# EAGLE schematic WiFiThermostat (EAGLE 6.2)
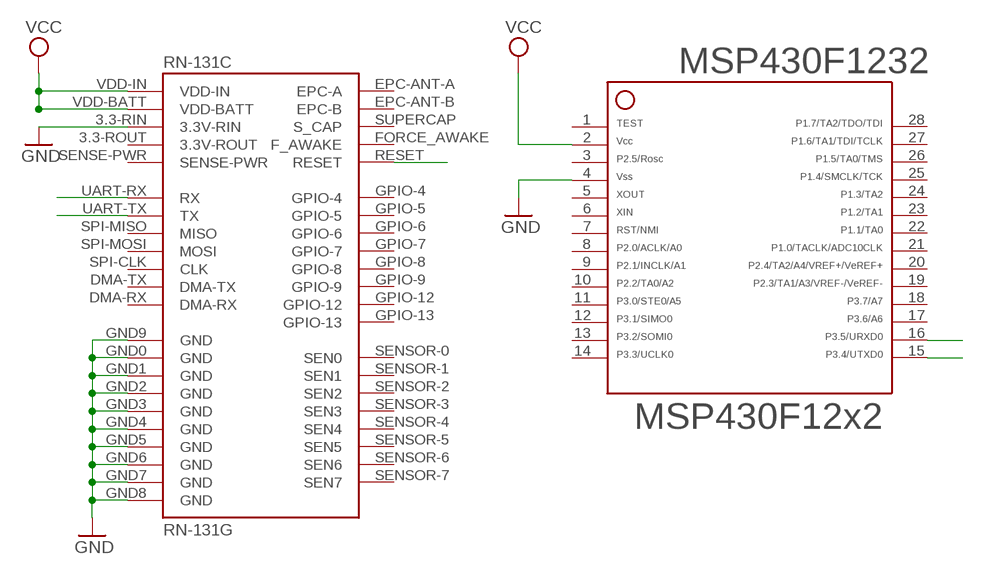
[diagram p0: schematic, sheet 1]

## Parts
MSP430F1232  F12X2---DW28  [DW28]
RN-131C  RN-131G  [RN-131G]

## Nets
GND: MSP430F1232.4 RN-131C.3.3-RIN(3.3V-RIN) RN-131C.GND0(GND) RN-131C.GND1(GND) RN-131C.GND2(GND) RN-131C.GND3(GND) RN-131C.GND4(GND) RN-131C.GND5(GND) RN-131C.GND6(GND) RN-131C.GND7(GND) RN-131C.GND8(GND) RN-131C.GND9(GND)
RESET: RN-131C.RESET
RN-RX: MSP430F1232.15 RN-131C.UART-RX(RX)
RN-TX: MSP430F1232.16 RN-131C.UART-TX(TX)
VCC: MSP430F1232.2 RN-131C.VDD-BATT RN-131C.VDD-IN
Unconnected: MSP430F1232.1 MSP430F1232.3 MSP430F1232.5 MSP430F1232.6 MSP430F1232.7 MSP430F1232.8 MSP430F1232.9 MSP430F1232.10 MSP430F1232.11 MSP430F1232.12 MSP430F1232.13 MSP430F1232.14 MSP430F1232.17 MSP430F1232.18 MSP430F1232.19 MSP430F1232.20 MSP430F1232.21 MSP430F1232.22 MSP430F1232.23 MSP430F1232.24 MSP430F1232.25 MSP430F1232.26 MSP430F1232.27 MSP430F1232.28 RN-131C.3.3-ROUT(3.3V-ROUT) RN-131C.DMA-RX RN-131C.DMA-TX RN-131C.EPC-ANT-A(EPC-A) RN-131C.EPC-ANT-B(EPC-B) RN-131C.FORCE_AWAKE(F_AWAKE) RN-131C.GPIO-4 RN-131C.GPIO-5 RN-131C.GPIO-6 RN-131C.GPIO-7 RN-131C.GPIO-8 RN-131C.GPIO-9 RN-131C.GPIO-12 RN-131C.GPIO-13 RN-131C.SENSE-PWR RN-131C.SENSOR-0(SEN0) RN-131C.SENSOR-1(SEN1) RN-131C.SENSOR-2(SEN2) RN-131C.SENSOR-3(SEN3) RN-131C.SENSOR-4(SEN4) RN-131C.SENSOR-5(SEN5) RN-131C.SENSOR-6(SEN6) RN-131C.SENSOR-7(SEN7) RN-131C.SPI-CLK(CLK) RN-131C.SPI-MISO(MISO) RN-131C.SPI-MOSI(MOSI) RN-131C.SUPERCAP(S_CAP)

## Library data of the parts
MSP430F1232 = TI_MSP430_v16:F12X2---DW28: *** MSP430F12x2 *** DW28
RN-131C = SparkFun:RN-131G: Roving Netowrks WiFLy GSX Module